# Altium schematic sheet Sheet1.SchDoc
size A4
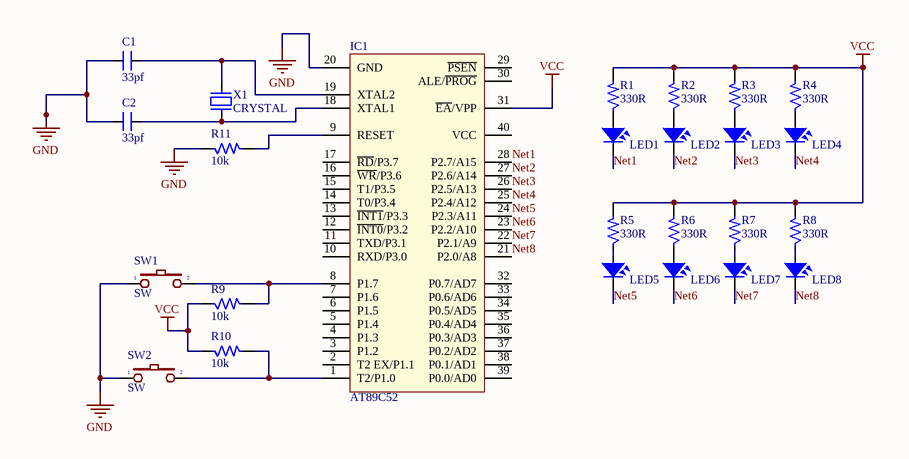
[diagram p0: Sheet1.SchDoc]

## Parts
C1  33pf  [SM-0805]
C2  33pf  [SM-0805]
IC1  AT89C52  [DIP40/W0.6]
LED1  LED  [LED-3]  (value not drawn)
LED2  LED  [LED-3]  (value not drawn)
LED3  LED  [LED-3]  (value not drawn)
LED4  LED  [LED-3]  (value not drawn)
LED5  LED  [LED-3]  (value not drawn)
LED6  LED  [LED-3]  (value not drawn)
LED7  LED  [LED-3]  (value not drawn)
LED8  LED  [LED-3]  (value not drawn)
R1  330R  [SM-RES-1206]
R2  330R  [SM-RES-1206]
R3  330R  [SM-RES-1206]
R4  330R  [SM-RES-1206]
R5  330R  [SM-RES-1206]
R6  330R  [SM-RES-1206]
R7  330R  [SM-RES-1206]
R8  330R  [SM-RES-1206]
R9  10k  [SM-RES-1206]
R10  10k  [SM-RES-1206]
R11  10k  [SM-RES-1206]
SW1  SW  [SW2]
SW2  SW  [SW2]
X1  CRYSTAL  [XT2]

## Nets
GND: C1.1 C2.1 IC1.20(GND) R11.1 SW1.1 SW2.1
VCC: IC1.31(~{EA}/VPP) R1.2 R2.2 R3.2 R4.2 R5.2 R6.2 R7.2 R8.2 R9.1 R10.1
Net1: IC1.28(P2.7/A15) LED1.2
Net2: IC1.27(P2.6/A14) LED2.2
Net3: IC1.26(P2.5/A13) LED3.2
Net4: IC1.25(P2.4/A12) LED4.2
Net5: IC1.24(P2.3/A11) LED5.2
Net6: IC1.23(P2.2/A10) LED6.2
Net7: IC1.22(P2.1/A9) LED7.2
Net8: IC1.21(P2.0/A8) LED8.2
NetC1_2: C1.2 IC1.19(XTAL2) X1.1
NetC2_2: C2.2 IC1.18(XTAL1) X1.2
NetIC1_1: IC1.1(T2/P1.0) R10.2 SW2.2
NetIC1_8: IC1.8(P1.7) R9.2 SW1.2
NetIC1_9: IC1.9(RESET) R11.2
NetLED5_1: LED5.1 R5.1
NetLED7_1: LED7.1 R7.1
NetLED8_1: LED8.1 R8.1

Not connected (* = marked no-connect by the designer): IC1 2(T2_EX/P1.1) 3(P1.2) 4(P1.3) 5(P1.4) 6(P1.5) 7(P1.6) 10(RXD/P3.0) 11(TXD/P3.1) 12(~{INT0}/P3.2) 13(~{INT1}/P3.3) 14(T0/P3.4) 15(T1/P3.5) 16(~{WR}/P3.6) 17(~{RD}/P3.7) 29(~{PSEN}) 30(ALE/~{PROG}) 32(P0.7/AD7) 33(P0.6/AD6) 34(P0.5/AD5) 35(P0.4/AD4) 36(P0.3/AD3) 37(P0.2/AD2) 38(P0.1/AD1) 39(P0.0/AD0) 40(VCC); LED1 1; LED2 1; LED3 1; LED4 1; LED6 1; R1 1; R2 1; R3 1; R4 1; R6 1

## Library data of the parts
C1 C2 = CM: Cap SMD; Value: 103
IC1 = AT89C52: Atmel AT89C52, 8k Byte Flash Memory , 40 Pin; Value: AT89C52
LED1-LED8 = LED: LED Single colour Green and Red; Value: LED 3 ly Single Colour
R1-R11 = R: Resistor 1/4W; Value: R1/4W - 1K
SW1 SW2 = SW2: Switch button 2 pin; Value: SW chip 2 pin
X1 = XT2: Crystal For all Crystal 2pin.; Value: 4Mhz